# EAGLE design kfly_4layer (EAGLE 5.11)
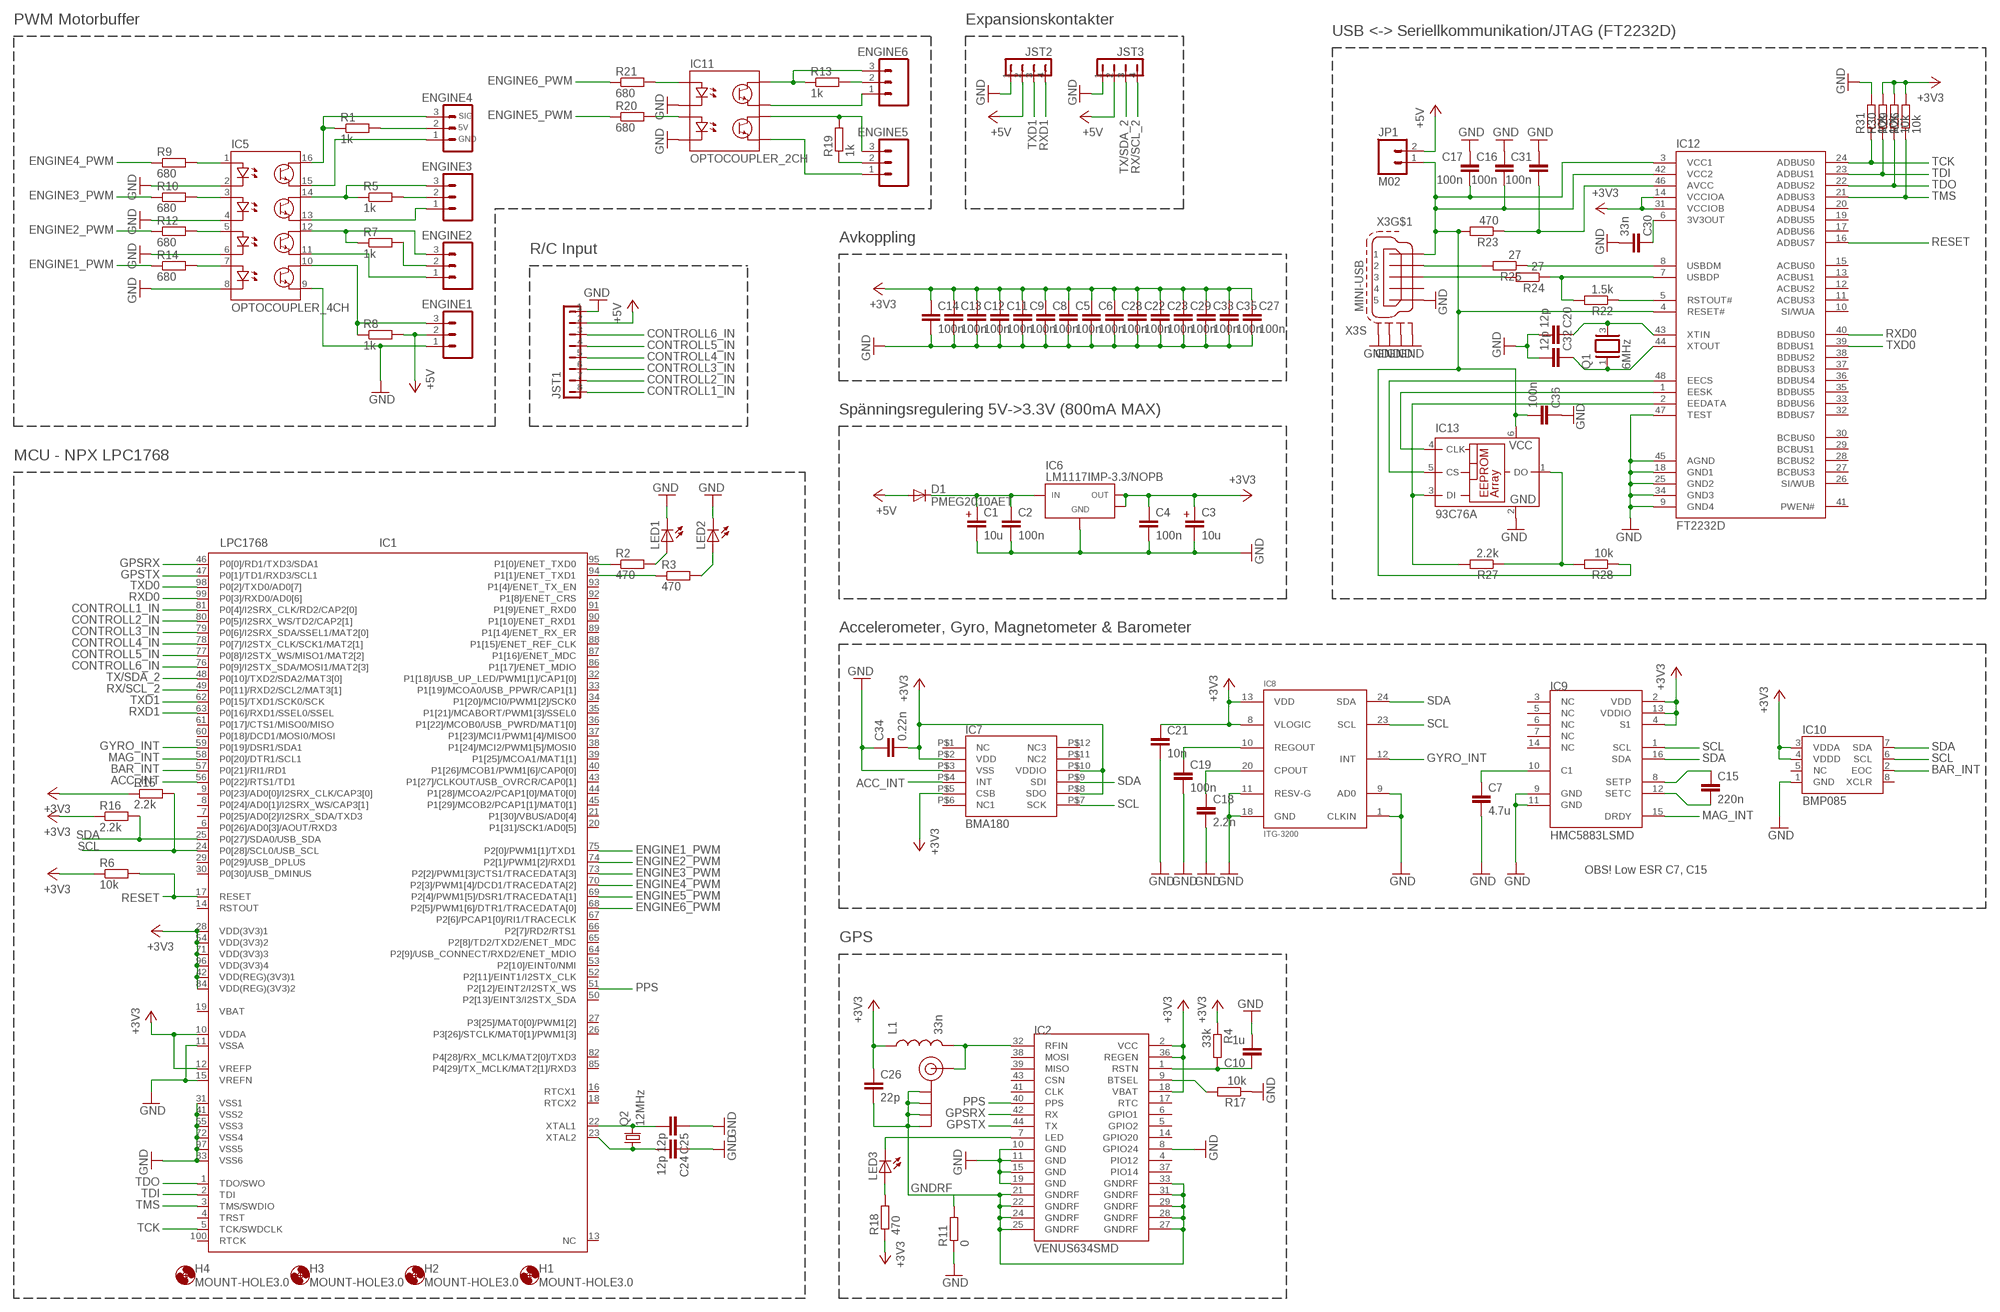
[diagram p0: schematic, sheet 1]

## Parts
C1  10u  C-EUC1206  [C1206]
C2  100n  C-EUC0603  [C0603]
C3  10u  C-EUC1206  [C1206]
C4  100n  C-EUC0603  [C0603]
C5  100n  C-EUC0603  [C0603]
C6  100n  C-EUC0603  [C0603]
C7  4.7u  C-EUC1206  [C1206]
C8  100n  C-EUC0603  [C0603]
C9  100n  C-EUC0603  [C0603]
C10  1u  C-EUC0603  [C0603]
C11  100n  C-EUC0603  [C0603]
C12  100n  C-EUC0603  [C0603]
C13  100n  C-EUC0603  [C0603]
C14  100n  C-EUC0603  [C0603]
C15  220n  C-EUC1206  [C1206]
C16  100n  C-EUC0603  [C0603]
C17  100n  C-EUC0603  [C0603]
C18  2.2n  C-EUC0603  [C0603]
C19  100n  C-EUC0603  [C0603]
C20  12p  C-EUC0603  [C0603]
C21  10n  C-EUC0603  [C0603]
C22  100n  C-EUC0603  [C0603]
C23  100n  C-EUC0603  [C0603]
C24  12p  C-EUC0603  [C0603]
C25  12p  C-EUC0603  [C0603]
C26  22p  C-EUC0603  [C0603]
C27  100n  C-EUC0603  [C0603]
C28  100n  C-EUC0603  [C0603]
C29  100n  C-EUC0603  [C0603]
C30  33n  C-EUC0603  [C0603]
C31  100n  C-EUC0603  [C0603]
C32  12p  C-EUC0603  [C0603]
C33  100n  C-EUC0603  [C0603]
C34  0.22n  C-EUC0603  [C0603]
C35  100n  C-EUC0603  [C0603]
C36  100n  C-EUC0603  [C0603]
D1  PMEG2010AET  DIODESOT23  [SOT23-3]
ENGINE1  M03  [M03]
ENGINE2  M03  [M03]
ENGINE3  M03  [M03]
ENGINE4  M03  [M03]
ENGINE5  M03  [M03]
ENGINE6  M03  [M03]
H1  MOUNT-HOLE3.0  [3,0]
H2  MOUNT-HOLE3.0  [3,0]
H3  MOUNT-HOLE3.0  [3,0]
H4  MOUNT-HOLE3.0  [3,0]
IC1  LPC1768  [LQFP100-14X14]
IC2  VENUS634SMD  [LGA44]
IC5  OPTOCOUPLER_4CH  [SO16]
IC6  LM1117IMP-3.3/NOPB  VREG_SOT223  [SOT223]
IC7  BMA180  [LGA12]
IC8  ITG-3200  [QFN-24]
IC9  HMC5883LSMD  [16LPCC]
IC10  BMP085  [BMP085]
IC11  OPTOCOUPLER_2CH  [SO8]
IC12  FT2232D  [LQFP-48]
IC13  93C76A  [SOT23-6]
J$1  SMA_EDGE  [SMA-EDGE]
JP1  M02  [M02]
JST1  JST-8PIN-TOP-1.0  [JST-8PIN-TOP]
JST2  JST-4PIN-TOP-1.0  [JST-4PIN-TOP]
JST3  JST-4PIN-TOP-1.0  [JST-4PIN-TOP]
L1  33n  INDUCTOR0805  [0805]
LED1  LED0603  [LED-0603]
LED2  LED0603  [LED-0603]
LED3  LED0603  [LED-0603]
Q1  6MHz  5X7CRYSTAL  [5X7CRYSTAL]
Q2  12MHz  CRYSTAL5X3  [CRYSTAL-SMD-5X3]
R1  1k  R-EU_R0402  [R0402]
R2  470  R-EU_R0603  [R0603]
R3  470  R-EU_R0603  [R0603]
R4  33k  R-EU_R0603  [R0603]
R5  1k  R-EU_R0402  [R0402]
R6  10k  R-EU_R0603  [R0603]
R7  1k  R-EU_R0402  [R0402]
R8  1k  R-EU_R0402  [R0402]
R9  680  R-EU_R0603  [R0603]
R10  680  R-EU_R0603  [R0603]
R11  0  R-EU_R0603  [R0603]
R12  680  R-EU_R0603  [R0603]
R13  1k  R-EU_R0402  [R0402]
R14  680  R-EU_R0603  [R0603]
R15  2.2k  R-EU_R0603  [R0603]
R16  2.2k  R-EU_R0603  [R0603]
R17  10k  R-EU_R0603  [R0603]
R18  470  R-EU_R0603  [R0603]
R19  1k  R-EU_R0402  [R0402]
R20  680  R-EU_R0603  [R0603]
R21  680  R-EU_R0603  [R0603]
R22  1.5k  R-EU_R0603  [R0603]
R23  470  R-EU_R0603  [R0603]
R24  27  R-EU_R0603  [R0603]
R25  27  R-EU_R0603  [R0603]
R26  10k  R-EU_R0603  [R0603]
R27  2.2k  R-EU_R0603  [R0603]
R28  10k  R-EU_R0603  [R0603]
R29  10k  R-EU_R0603  [R0603]
R30  10k  R-EU_R0603  [R0603]
R31  10k  R-EU_R0603  [R0603]
X3  MINI-USB  MINI-USB-SCHIELD-32005-201  [32005-201]

## Nets
+3V3: C3.1 C4.1 C5.1 C6.1 C8.1 C9.1 C11.1 C12.1 C13.1 C14.1 C21.1 C22.1 C23.1 C26.1 C27.1 C28.1 C29.1 C33.1 C34.2 C35.1 IC1.10(VDDA) IC1.12(VREFP) IC1.28(VDD(3V3)1) IC1.42(VDD(REG)(3V3)1) IC1.54(VDD(3V3)2) IC1.71(VDD(3V3)3) IC1.84(VDD(REG)(3V3)2) IC1.96(VDD(3V3)4) IC2.2(VCC) IC2.18(VBAT) IC2.36(REGEN) IC6.2 IC6.4 IC7.P$2(VDD) IC7.P$5(CSB) IC7.P$8(SDO) IC7.P$10(VDDIO) IC8.8(VLOGIC) IC8.13(VDD) IC9.2(VDD) IC9.4(S1) IC9.13(VDDIO) IC10.3(VDDA) IC10.4(VDDD) IC12.14(VCCIOA) IC12.31(VCCIOB) L1.1 R4.1 R6.1 R15.1 R16.1 R18.1 R26.2 R29.2 R30.2
+5V: D1.1(A) ENGINE1.2 JP1.2 JST1.2 JST2.2 JST3.2 R8.2
ACC_INT: IC1.56(P0[22]/RTS1/TD1) IC7.P$4(INT)
BAR_INT: IC1.57(P0[21]/RI1/RD1) IC10.2(EOC)
CONTROLL1_IN: IC1.81(P0[4]/I2SRX_CLK/RD2/CAP2[0]) JST1.8
CONTROLL2_IN: IC1.80(P0[5]/I2SRX_WS/TD2/CAP2[1]) JST1.7
CONTROLL3_IN: IC1.79(P0[6]/I2SRX_SDA/SSEL1/MAT2[0]) JST1.6
CONTROLL4_IN: IC1.78(P0[7]/I2STX_CLK/SCK1/MAT2[1]) JST1.5
CONTROLL5_IN: IC1.77(P0[8]/I2STX_WS/MISO1/MAT2[2]) JST1.4
CONTROLL6_IN: IC1.76(P0[9]/I2STX_SDA/MOSI1/MAT2[3]) JST1.3
ENGINE1_PWM: IC1.75(P2[0]/PWM1[1]/TXD1) R14.1
ENGINE2_PWM: IC1.74(P2[1]/PWM1[2]/RXD1) R12.1
ENGINE3_PWM: IC1.73(P2[2]/PWM1[3]/CTS1/TRACEDATA[3]) R10.1
ENGINE4_PWM: IC1.70(P2[3]/PWM1[4]/DCD1/TRACEDATA[2]) R9.1
ENGINE5_PWM: IC1.69(P2[4]/PWM1[5]/DSR1/TRACEDATA[1]) R20.1
ENGINE6_PWM: IC1.68(P2[5]/PWM1[6]/DTR1/TRACEDATA[0]) R21.1
GND: C1.2 C2.2 C3.2 C4.2 C5.2 C6.2 C7.2 C8.2 C9.2 C10.2 C11.2 C12.2 C13.2 C14.2 C16.1 C17.1 C18.2 C19.2 C20.2 C21.2 C22.2 C23.2 C24.1 C25.1 C27.2 C28.2 C29.2 C30.2 C31.1 C32.2 C33.2 C34.1 C35.2 C36.1 ENGINE1.1 IC1.11(VSSA) IC1.15(VREFN) IC1.31(VSS1) IC1.41(VSS2) IC1.55(VSS3) IC1.72(VSS4) IC1.83(VSS6) IC1.97(VSS5) IC2.8(GPIO24) IC2.10(GND) IC2.11(GND) IC2.15(GND) IC2.19(GND) IC5.2 IC5.4 IC5.6 IC5.8 IC5.9 IC6.1 IC7.P$3(VSS) IC8.1(CLKIN) IC8.9(AD0) IC8.11(RESV-G) IC8.18(GND) IC9.9(GND) IC9.11(GND) IC10.1(GND) IC11.2 IC11.4 IC12.9(GND4) IC12.18(GND1) IC12.25(GND2) IC12.34(GND3) IC12.45(AGND) IC12.47(TEST) IC13.2(GND) JST1.1 JST2.1 JST3.1 LED1.C LED2.C R11.1 R17.1 R31.2 X3.5 X3.M1(S:S1) X3.M2(S:S2) X3.M3(S:S3) X3.M4(S:S4)
GNDRF: C26.2 IC2.21(GNDRF) IC2.22(GNDRF) IC2.24(GNDRF) IC2.25(GNDRF) IC2.27(GNDRF) IC2.28(GNDRF) IC2.29(GNDRF) IC2.31(GNDRF) IC2.33(GNDRF) J$1.GND@0(GND) J$1.GND@1(GND) J$1.GND@2(GND) J$1.GND@3(GND) R11.2
GPSRX: IC1.46(P0[0]/RD1/TXD3/SDA1) IC2.42(RX)
GPSTX: IC1.47(P0[1]/TD1/RXD3/SCL1) IC2.44(TX)
GYRO_INT: IC1.59(P0[19]/DSR1/SDA1) IC8.12(INT)
MAG_INT: IC1.58(P0[20]/DTR1/SCL1) IC9.15(DRDY)
N$1: C7.1 IC9.10(C1)
N$2: R25.2 X3.2
N$3: ENGINE4.1 IC5.15
N$4: IC12.8(USBDM) R25.1
N$5: ENGINE6.3 IC11.8 R13.1
N$6: ENGINE6.1 IC11.7
N$7: IC12.7(USBDP) R22.2 R24.1
N$8: C15.1 IC9.8(SETP)
N$9: IC1.95(P1[0]/ENET_TXD0) R2.1
N$10: C15.2 IC9.12(SETC)
N$11: ENGINE6.2 R13.2
N$12: ENGINE5.3 IC11.6 R19.2
N$13: C18.1 IC8.20(CPOUT)
N$14: C19.1 IC8.10(REGOUT)
N$15: LED1.A R2.2
N$16: C16.2 C17.2 C36.2 IC12.3(VCC1) IC12.4(RESET#) IC12.42(VCC2) IC13.6(VCC) JP1.1 R23.2 R28.1 X3.1
N$17: ENGINE4.3 IC5.16 R1.1
N$18: IC1.94(P1[1]/ENET_TXD1) R3.1
N$19: IC2.32(RFIN) J$1.SIG(SIGNAL) L1.2
N$20: LED2.A R3.2
N$21: C10.1 IC2.1(RSTN) R4.2
N$22: ENGINE4.2 R1.2
N$23: C1.1 C2.1 D1.3(C) IC6.3
N$24: ENGINE3.1 IC5.13
N$25: ENGINE3.3 IC5.14 R5.1
N$26: ENGINE3.2 R5.2
N$27: ENGINE2.3 IC5.12 R7.1
N$28: ENGINE2.1 IC5.11
N$29: ENGINE2.2 R7.2
N$30: ENGINE1.3 IC5.10 R8.1
N$31: IC5.1 R9.2
N$32: IC5.3 R10.2
N$33: IC5.5 R12.2
N$34: IC5.7 R14.2
N$35: IC2.9(BTSEL) R17.2
N$36: ENGINE5.2 R19.1
N$37: ENGINE5.1 IC11.5
N$38: IC11.1 R21.2
N$39: LED3.A R18.2
N$40: IC2.7(LED) LED3.C
N$41: IC11.3 R20.2
N$42: C25.2 IC1.22(XTAL1) Q2.3
N$43: C24.2 IC1.23(XTAL2) Q2.1
N$45: R24.2 X3.3
N$46: IC12.1(EESK) IC13.4(CLK)
N$47: C31.2 IC12.46(AVCC) R23.1
N$48: C30.1 IC12.6(3V3OUT)
N$49: IC12.48(EECS) IC13.5(CS)
N$51: IC12.5(RSTOUT#) R22.1
N$52: C20.1 IC12.43(XTIN) Q1.3
N$53: C32.1 IC12.44(XTOUT) Q1.1
N$54: IC12.2(EEDATA) IC13.3(DI) R27.2
N$55: IC13.1(DO) R27.1 R28.2
PPS: IC1.51(P2[12]/EINT2/I2STX_WS) IC2.40(PPS)
RESET: IC1.17(RESET) IC12.16(ADBUS7) R6.2
RX/SCL_2: IC1.49(P0[11]/RXD2/SCL2/MAT3[1]) JST3.4
RXD0: IC1.99(P0[3]/RXD0/AD0[6]) IC12.40(BDBUS0)
RXD1: IC1.63(P0[16]/RXD1/SSEL0/SSEL) JST2.4
SCL: IC1.24(P0[28]/SCL0/USB_SCL) IC7.P$7(SCK) IC8.23(SCL) IC9.1(SCL) IC10.6(SCL) R15.2
SDA: IC1.25(P0[27]/SDA0/USB_SDA) IC7.P$9(SDI) IC8.24(SDA) IC9.16(SDA) IC10.7(SDA) R16.2
TCK: IC1.5(TCK/SWDCLK) IC12.24(ADBUS0) R31.1
TDI: IC1.2(TDI) IC12.23(ADBUS1) R30.1
TDO: IC1.1(TDO/SWO) IC12.22(ADBUS2) R29.1
TMS: IC1.3(TMS/SWDIO) IC12.21(ADBUS3) R26.1
TX/SDA_2: IC1.48(P0[10]/TXD2/SDA2/MAT3[0]) JST3.3
TXD0: IC1.98(P0[2]/TXD0/AD0[7]) IC12.39(BDBUS1)
TXD1: IC1.62(P0[15]/TXD1/SCK0/SCK) JST2.3
Unconnected: IC1.4(TRST) IC1.6(P0[26]/AD0[3]/AOUT/RXD3) IC1.7(P0[25]/AD0[2]/I2SRX_SDA/TXD3) IC1.8(P0[24]/AD0[1]/I2SRX_WS/CAP3[1]) IC1.9(P0[23]/AD0[0]/I2SRX_CLK/CAP3[0]) IC1.13(NC) IC1.14(RSTOUT) IC1.16(RTCX1) IC1.18(RTCX2) IC1.19(VBAT) IC1.20(P1[31]/SCK1/AD0[5]) IC1.21(P1[30]/VBUS/AD0[4]) IC1.26(P3[26]/STCLK/MAT0[1]/PWM1[3]) IC1.27(P3[25]/MAT0[0]/PWM1[2]) IC1.29(P0[29]/USB_DPLUS) IC1.30(P0[30]/USB_DMINUS) IC1.32(P1[18]/USB_UP_LED/PWM1[1]/CAP1[0]) IC1.33(P1[19]/MCOA0/USB_PPWR/CAP1[1]) IC1.34(P1[20]/MCI0/PWM1[2]/SCK0) IC1.35(P1[21]/MCABORT/PWM1[3]/SSEL0) IC1.36(P1[22]/MCOB0/USB_PWRD/MAT1[0]) IC1.37(P1[23]/MCI1/PWM1[4]/MISO0) IC1.38(P1[24]/MCI2/PWM1[5]/MOSI0) IC1.39(P1[25]/MCOA1/MAT1[1]) IC1.40(P1[26]/MCOB1/PWM1[6]/CAP0[0]) IC1.43(P1[27]/CLKOUT/USB_OVRCR/CAP0[1]) IC1.44(P1[28]/MCOA2/PCAP1[0]/MAT0[0]) IC1.45(P1[29]/MCOB2/PCAP1[1]/MAT0[1]) IC1.50(P2[13]/EINT3/I2STX_SDA) IC1.52(P2[11]/EINT1/I2STX_CLK) IC1.53(P2[10]/EINT0/NMI) IC1.60(P0[18]/DCD1/MOSI0/MOSI) IC1.61(P0[17]/CTS1/MISO0/MISO) IC1.64(P2[9]/USB_CONNECT/RXD2/ENET_MDIO) IC1.65(P2[8]/TD2/TXD2/ENET_MDC) IC1.66(P2[7]/RD2/RTS1) IC1.67(P2[6]/PCAP1[0]/RI1/TRACECLK) IC1.82(P4[28]/RX_MCLK/MAT2[0]/TXD3) IC1.85(P4[29]/TX_MCLK/MAT2[1]/RXD3) IC1.86(P1[17]/ENET_MDIO) IC1.87(P1[16]/ENET_MDC) IC1.88(P1[15]/ENET_REF_CLK) IC1.89(P1[14]/ENET_RX_ER) IC1.90(P1[10]/ENET_RXD1) IC1.91(P1[9]/ENET_RXD0) IC1.92(P1[8]/ENET_CRS) IC1.93(P1[4]/ENET_TX_EN) IC1.100(RTCK) IC2.4(PIO12) IC2.5(GPIO2) IC2.6(GPIO1) IC2.14(GPIO20) IC2.17(RTC) IC2.37(PIO14) IC2.38(MOSI) IC2.39(MISO) IC2.41(CLK) IC2.43(CSN) IC7.P$1(NC) IC7.P$6(NC1) IC7.P$11(NC2) IC7.P$12(NC3) IC9.3(NC) IC9.5(NC) IC9.6(NC) IC9.7(NC) IC9.14(NC) IC10.5(NC) IC10.8(XCLR) IC12.10(SI/WUA) IC12.11(ACBUS3) IC12.12(ACBUS2) IC12.13(ACBUS1) IC12.15(ACBUS0) IC12.17(ADBUS6) IC12.19(ADBUS5) IC12.20(ADBUS4) IC12.26(SI/WUB) IC12.27(BCBUS3) IC12.28(BCBUS2) IC12.29(BCBUS1) IC12.30(BCBUS0) IC12.32(BDBUS7) IC12.33(BDBUS6) IC12.35(BDBUS5) IC12.36(BDBUS4) IC12.37(BDBUS3) IC12.38(BDBUS2) IC12.41(PWEN#) X3.4

## Notes on the sheet
- PWM Motorbuffer | Expansionskontakter
- USB <-> Seriellkommunikation/JTAG (FT2232D)
- SIG
- 5V
- GND
- Avkoppling
- R/C Input
- Spänningsregulering 5V->3.3V (800mA MAX)
- MCU - NPX LPC1768
- + | +
- Accelerometer, Gyro, Magnetometer & Barometer
- OBS! Low ESR C7, C15
- GPS

## Library data of the parts
C1-C36 = rcl:C-EU: CAPACITOR, European symbol
D1 = SparkFun:DIODE: Diode These are standard reverse protection diodes and small signal diodes. SMA package can handle up to about 1A. SOD-323 can handle about 200mA. What the SOD-323 package when ordering, there are some mfgs out there that are 5-pin packages.
ENGINE1-ENGINE6 = korken:M03
H1-H4 = holes:MOUNT-HOLE: MOUNTING HOLE with drill center marker
IC1 = lpc1xxx-v6:LPC1768: LPC1768 100 MHz 32-bit ARM Cortex-M3 based microcontroller featuring a high level of integration and low power consumption. 512 kB Flash, 64 kB SRAM, USB Device/Host/OTG, 2 CAN, DAC, Ethernet MarcVl - Datasheet available on www.nxp.com
IC2 = SparkFun:VENUS634: Venus634 from SkyTraq
IC5 = korken:OPTOCOUPLER_4CH
IC6 = korken:VREG_SOT223
IC7 = SparkFun:BMA180
IC8 = SparkFun:ITG-3200: ITG-3200 3-axis gyro, digital output, qfn24 package
IC9 = SparkFun:HMC5883L: 3 Axis Digital Compass IC
IC10 = SparkFun:BMP085: BMP085 Pressure Sensor Great little MEMS pressure sensor. SKU: COM-09603
IC11 = korken:OPTOCOUPLER_2CH
IC12 = SparkFun:FT2232D
IC13 = microchip:93*76?: 8K Microwire Compatible Serial EEPROM Source: http://ww1.microchip.com/downloads/en/DeviceDoc/21796H.pdf
J$1 = SparkFun:SMA_EDGE: SMA Antenna Connector End launch SMA connector. The paste layer has been removed so that the connector can be hand soldered onto the board after reflow.
JP1 = korken:M02
JST1 = korken:JST-8PIN-TOP-1.0
JST2 JST3 = korken:JST-4PIN-TOP-1.0
L1 = SparkFun:INDUCTOR: Inductors Basic Inductor/Choke - 0603 and 1206. Footprints are not proven and vary greatly between part numbers.
LED1-LED3 = SparkFun:LED: LEDs Standard schematic elements and footprints for 5mm, 3mm, 1206, and 0603 sized LEDs. 5mm - Spark Fun Electronics SKU : COM-00529 (and others)
Q1 = korken:5X7CRYSTAL
Q2 = SparkFun:CRYSTAL: Crystals Various standard crystals. Proven footprints. Spark Fun Electronics SKU : COM-00534
R1-R31 = rcl:R-EU_: RESISTOR, European symbol
X3 = con-cypressindustries:MINI-USB-SCHIELD-: MINI USB-B Conector Source: www.cypressindustries.com

## Board
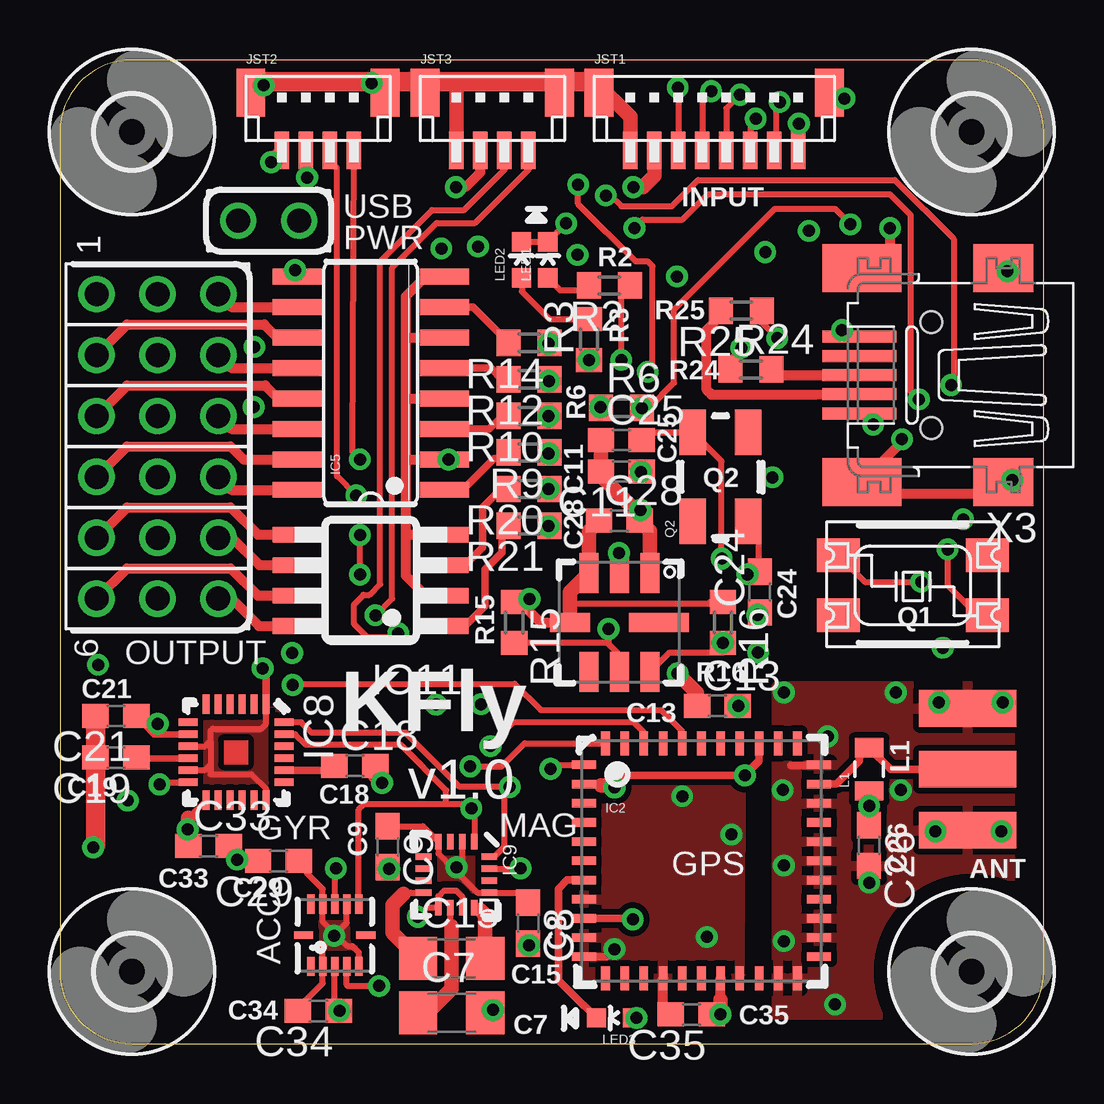
[diagram p1: board, top side]
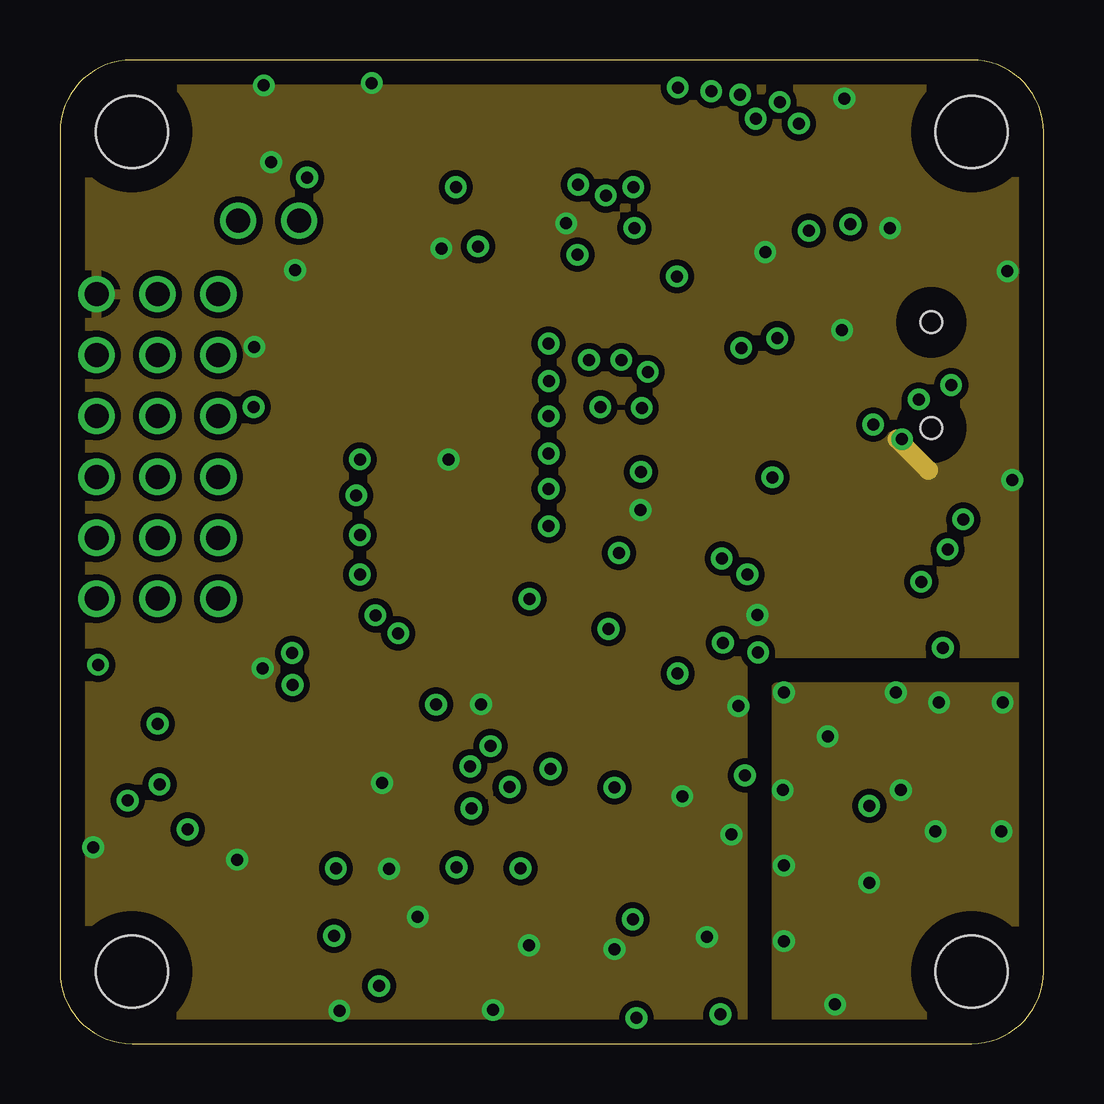
[diagram p2: board, inner layer Inner1]
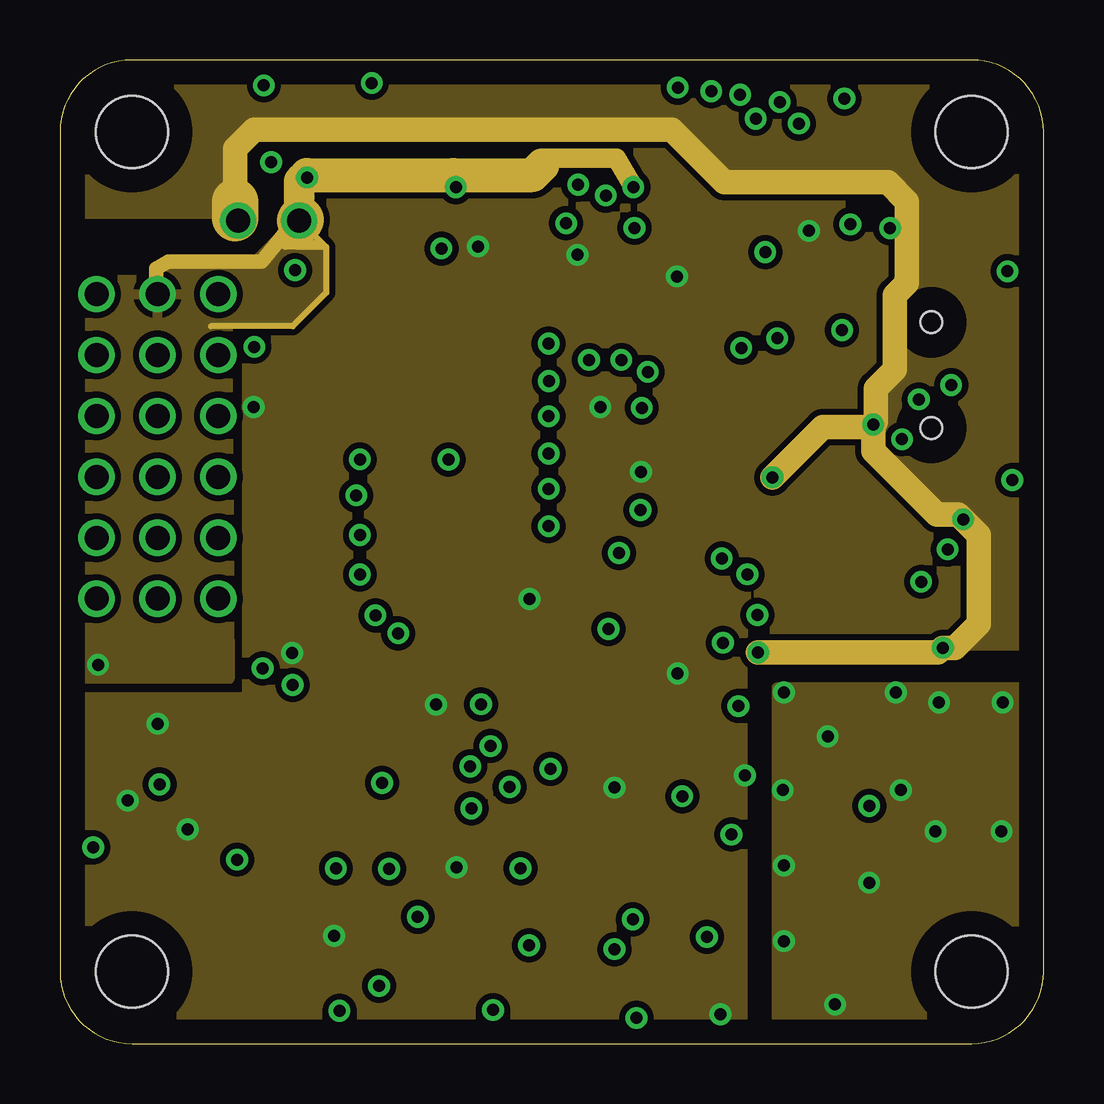
[diagram p3: board, inner layer Inner2]
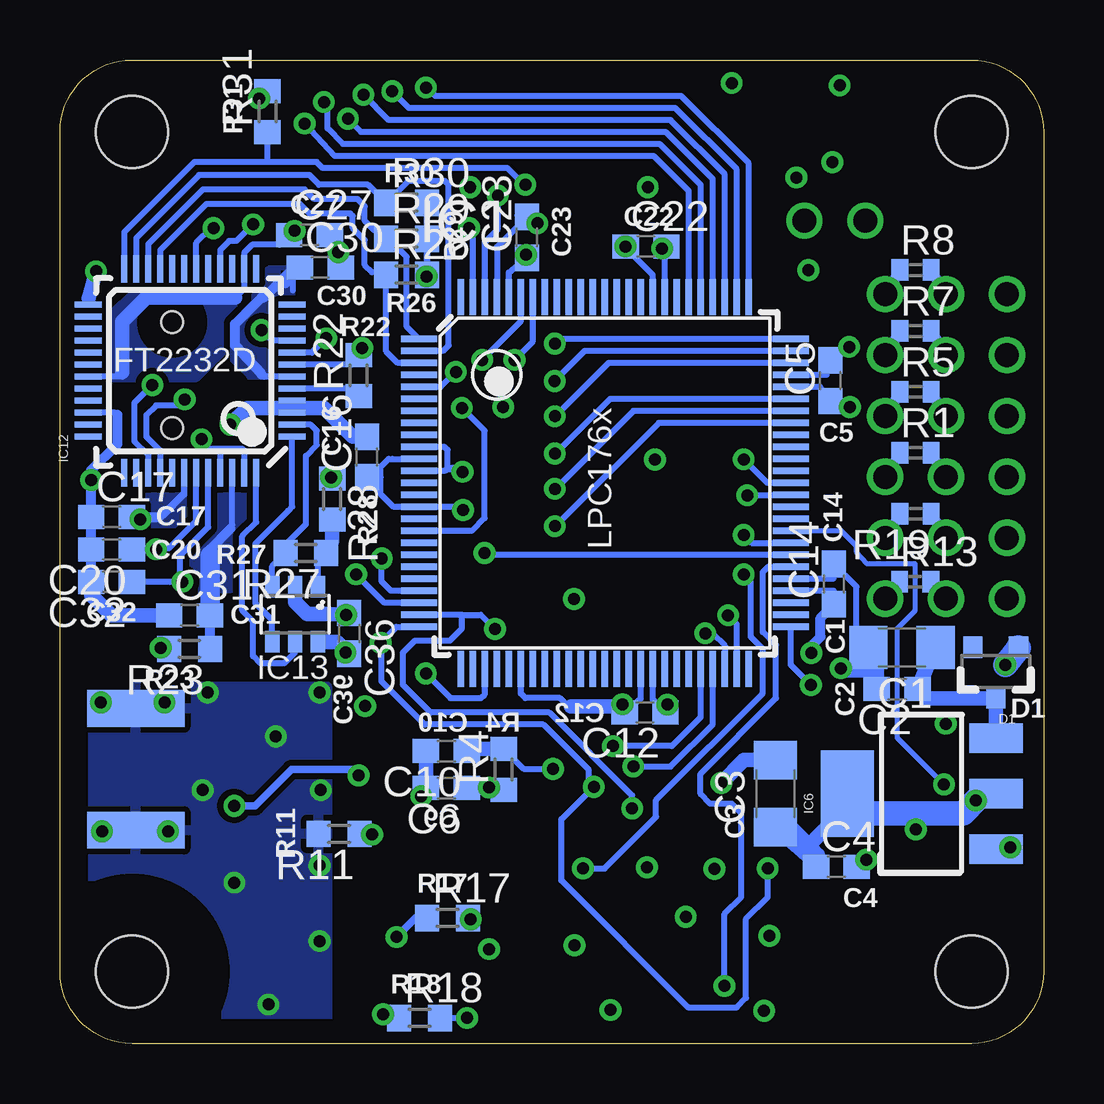
[diagram p4: board, bottom side, seen from below]

Size 41 x 41 mm. Coordinates in mm from the lower left corner, seen from the top.
Outline: 41,38 arc90 38,41 3,41 arc90 0,38 0,3 arc90 3,0 38,0 arc90 41,3 41,38
Copper layers (1*2*15*16): Top 0.035mm / dielectric 1.5mm / Inner1 0.035mm / dielectric 0.15mm / Inner2 0.035mm / dielectric 0.2mm / Bottom 0.035mm
Design rules "default *": minimum track width 10mil, minimum drill 24mil, track to track 10mil, track to pad 10mil, pad to pad 10mil, via to via 10mil, smd to smd 10mil, copper to edge 40mil, drill to drill 8mil, minimum pad ring 10mil, minimum via ring 8mil, stop-mask expansion 4mil, vias tented up to drill 0mil, thermal gap 10mil

### Footprints (pad centres in the part's own frame; a part is rotated, then mirrored left to right if it is on the bottom)
C1206 = smd 1.6 x 1.8: 1 -1.4,0; 2 1.4,0
C0603 = smd 1.1 x 1: 1 -0.85,0; 2 0.85,0
SOT23-3 = smd 0.8 x 0.9: 1 -0.95,-1; 2 0.95,-1; 3 0,1.1
M03 = drill 1 round: 1 -2.54,0; 2 0,0; 3 2.54,0
3,0 = hole 3: 0,0
LQFP100-14X14 = smd 0.27 x 1.5: 1 -6,-7.75; 2 -5.5,-7.75; 3 -5,-7.75; 4 -4.5,-7.75; 5 -4,-7.75; 6 -3.5,-7.75; 7 -3,-7.75; 8 -2.5,-7.75; 9 -2,-7.75; 10 -1.5,-7.75; 11 -1,-7.75; 12 -0.5,-7.75; 13 0,-7.75; 14 0.5,-7.75; 15 1,-7.75; 16 1.5,-7.75; 17 2,-7.75; 18 2.5,-7.75; 19 3,-7.75; 20 3.5,-7.75; 21 4,-7.75; 22 4.5,-7.75; 23 5,-7.75; 24 5.5,-7.75; 25 6,-7.75; 51 6,7.75; 52 5.5,7.75; 53 5,7.75; 54 4.5,7.75; 55 4,7.75; 56 3.5,7.75; 57 3,7.75; 58 2.5,7.75; 59 2,7.75; 60 1.5,7.75; 61 1,7.75; 62 0.5,7.75; 63 0,7.75; 64 -0.5,7.75; 65 -1,7.75; 66 -1.5,7.75; 67 -2,7.75; 68 -2.5,7.75; 69 -3,7.75; 70 -3.5,7.75; 71 -4,7.75; 72 -4.5,7.75; 73 -5,7.75; 74 -5.5,7.75; 75 -6,7.75 | smd 1.5 x 0.27: 26 7.75,-6; 27 7.75,-5.5; 28 7.75,-5; 29 7.75,-4.5; 30 7.75,-4; 31 7.75,-3.5; 32 7.75,-3; 33 7.75,-2.5; 34 7.75,-2; 35 7.75,-1.5; 36 7.75,-1; 37 7.75,-0.5; 38 7.75,0; 39 7.75,0.5; 40 7.75,1; 41 7.75,1.5; 42 7.75,2; 43 7.75,2.5; 44 7.75,3; 45 7.75,3.5; 46 7.75,4; 47 7.75,4.5; 48 7.75,5; 49 7.75,5.5; 50 7.75,6; 76 -7.75,6; 77 -7.75,5.5; 78 -7.75,5; 79 -7.75,4.5; 80 -7.75,4; 81 -7.75,3.5; 82 -7.75,3; 83 -7.75,2.5; 84 -7.75,2; 85 -7.75,1.5; 86 -7.75,1; 87 -7.75,0.5; 88 -7.75,0; 89 -7.75,-0.5; 90 -7.75,-1; 91 -7.75,-1.5; 92 -7.75,-2; 93 -7.75,-2.5; 94 -7.75,-3; 95 -7.75,-3.5; 96 -7.75,-4; 97 -7.75,-4.5; 98 -7.75,-5; 99 -7.75,-5.5; 100 -7.75,-6
LGA44 = smd 1 x 0.36: 1 -4.9,4; 2 -4.9,3.2; 3 -4.9,2.4; 4 -4.9,1.6; 5 -4.9,0.8; 6 -4.9,0; 7 -4.9,-0.8; 8 -4.9,-1.6; 9 -4.9,-2.4; 10 -4.9,-3.2; 11 -4.9,-4; 23 4.9,-4; 24 4.9,-3.2; 25 4.9,-2.4; 26 4.9,-1.6; 27 4.9,-0.8; 28 4.9,0; 29 4.9,0.8; 30 4.9,1.6; 31 4.9,2.4; 32 4.9,3.2; 33 4.9,4 | smd 0.36 x 1: 12 -4,-4.9; 13 -3.2,-4.9; 14 -2.4,-4.9; 15 -1.6,-4.9; 16 -0.8,-4.9; 17 0,-4.9; 18 0.8,-4.9; 19 1.6,-4.9; 20 2.4,-4.9; 21 3.2,-4.9; 22 4,-4.9; 34 4,4.9; 35 3.2,4.9; 36 2.4,4.9; 37 1.6,4.9; 38 0.8,4.9; 39 0,4.9; 40 -0.8,4.9; 41 -1.6,4.9; 42 -2.4,4.9; 43 -3.2,4.9; 44 -4,4.9
SO16 = smd 0.66 x 2.032: 1 -4.605,-3.073; 2 -3.335,-3.073; 3 -2.065,-3.073; 4 -0.795,-3.073; 5 0.475,-3.073; 6 1.745,-3.073; 7 3.015,-3.073; 8 4.285,-3.073; 9 4.285,3.073; 10 3.015,3.073; 11 1.745,3.073; 12 0.475,3.073; 13 -0.795,3.073; 14 -2.065,3.073; 15 -3.335,3.073; 16 -4.605,3.073
SOT223 = smd 1.219 x 2.235: 1 -2.311,-3.099; 2 0,-3.099; 3 2.311,-3.099 | smd 3.6 x 2.2: 4 0,3.099
LGA12 = smd 0.8 x 0.32: P$1 -1.3,1; P$2 -1.3,0.5; P$3 -1.3,0; P$4 -1.3,-0.5; P$5 -1.3,-1; P$7 1.3,-1; P$8 1.3,-0.5; P$9 1.3,0; P$10 1.3,0.5; P$11 1.3,1 | smd 0.32 x 0.8: P$6 0,-1.3; P$12 0,1.3
QFN-24 = smd 0.8 x 0.3: 1 -2,1.25; 2 -2,0.75; 3 -2,0.25; 4 -2,-0.25; 5 -2,-0.75; 6 -2,-1.25; 13 2,-1.25; 14 2,-0.75; 15 2,-0.25; 16 2,0.25; 17 2,0.75; 18 2,1.25 | smd 0.3 x 0.8: 7 -1.25,-2; 8 -0.75,-2; 9 -0.25,-2; 10 0.25,-2; 11 0.75,-2; 12 1.25,-2; 19 1.25,2; 20 0.75,2; 21 0.25,2; 22 -0.25,2; 23 -0.75,2; 24 -1.25,2
16LPCC = smd 0.65 x 0.28: 1 -1.37,0.75; 2 -1.37,0.25; 3 -1.37,-0.25; 4 -1.37,-0.75; 9 1.37,-0.75; 10 1.37,-0.25; 11 1.37,0.25; 12 1.37,0.75 | smd 0.28 x 0.65: 5 -0.75,-1.37; 6 -0.25,-1.37; 7 0.25,-1.37; 8 0.75,-1.37; 13 0.75,1.37; 14 0.25,1.37; 15 -0.25,1.37; 16 -0.75,1.37
BMP085 = smd 1.67 x 0.8: 1 -2.065,1.27; 2 -2.065,0; 3 -2.065,-1.27; 5 2.065,-1.27; 6 2.065,0; 7 2.065,1.27 | smd 0.8 x 1.67: 4 0,-2.065 | smd 0.8 x 2.5: 8 0,1.65
SO8 = smd 0.66 x 2.032: 1 -1.905,-3.066; 2 -0.635,-3.066; 3 0.635,-3.066; 4 1.905,-3.066; 5 1.905,3.066; 6 0.635,3.066; 7 -0.635,3.066; 8 -1.905,3.066
LQFP-48 = smd 0.254 x 1.143: 1 -2.75,-4.25; 2 -2.25,-4.25; 3 -1.75,-4.25; 4 -1.25,-4.25; 5 -0.75,-4.25; 6 -0.25,-4.25; 7 0.25,-4.25; 8 0.75,-4.25; 9 1.25,-4.25; 10 1.75,-4.25; 11 2.25,-4.25; 12 2.75,-4.25; 25 2.75,4.25; 26 2.25,4.25; 27 1.75,4.25; 28 1.25,4.25; 29 0.75,4.25; 30 0.25,4.25; 31 -0.25,4.25; 32 -0.75,4.25; 33 -1.25,4.25; 34 -1.75,4.25; 35 -2.25,4.25; 36 -2.75,4.25 | smd 1.143 x 0.254: 13 4.25,-2.75; 14 4.25,-2.25; 15 4.25,-1.75; 16 4.25,-1.25; 17 4.25,-0.75; 18 4.25,-0.25; 19 4.25,0.25; 20 4.25,0.75; 21 4.25,1.25; 22 4.25,1.75; 23 4.25,2.25; 24 4.25,2.75; 37 -4.25,2.75; 38 -4.25,2.25; 39 -4.25,1.75; 40 -4.25,1.25; 41 -4.25,0.75; 42 -4.25,0.25; 43 -4.25,-0.25; 44 -4.25,-0.75; 45 -4.25,-1.25; 46 -4.25,-1.75; 47 -4.25,-2.25; 48 -4.25,-2.75
SOT23-6 = smd 0.6 x 0.9: 1 -0.95,-1.15; 2 0,-1.15; 3 0.95,-1.15; 4 0.95,1.15; 5 0,1.15; 6 -0.95,1.15
SMA-EDGE = smd 1.524 x 4.064: GND@0 0,0; GND@1 5.08,0; SIG 2.54,0 | smd 1.524 x 4.064 bottom: GND@2 0,0; GND@3 5.08,0
M02 = drill 1 round: 1 -1.27,0; 2 1.27,0
JST-8PIN-TOP = smd 0.6 x 1.55: 1 -5,0; 2 -4,0; 3 -3,0; 4 -2,0; 5 -1,0; 6 0,0; 7 1,0; 8 2,0 | smd 1.2 x 2: NC1 3.3,2.4; NC2 -6.3,2.4
JST-4PIN-TOP = smd 0.6 x 1.55: 1 -2,0; 2 -1,0; 3 0,0; 4 1,0 | smd 1.2 x 2: NC1 2.3,2.4; NC2 -3.3,2.4
0805 = smd 0.8 x 1.2: 1 -0.9,0; 2 0.9,0
LED-0603 = smd 0.8 x 0.8: A 0,-0.75; C 0,0.75
5X7CRYSTAL = smd 1.8 x 1.4: 1 -3.1,1.3; 2 3.1,1.3; 3 3.1,-1.2; 4 -3.1,-1.2
CRYSTAL-SMD-5X3 = smd 1.9 x 1.1: 1 -1.85,-1.15; 2 1.85,-1.15; 3 1.85,1.15; 4 -1.85,1.15
R0402 = smd 0.7 x 0.9: 1 -0.65,0; 2 0.65,0
R0603 = smd 1 x 1.1: 1 -0.85,0; 2 0.85,0
32005-201 = smd 3.1 x 0.5: 1 3,1.6; 2 3,0.8; 3 3,0; 4 3,-0.8; 5 3,-1.6 | smd 2.5 x 2: M1 -3,-4.45; M2 -3,4.45 | smd 3.3 x 2: M3 2.9,4.45; M4 2.9,-4.45 | hole 0.9: 0,2.2; 0,-2.2

### Placement (x,y rotation side)
C1  5.9,16.51 180 bottom
C2  6.1,14.78 180 bottom
C3  11.18,10.41 90 bottom
C4  8.64,7.37 0 bottom
C5  8.89,27.63 90 bottom
C6  24.89,10.65 180 bottom
C7  16.33,1.28 0 top
C8  19.52,5.02 270 top
C9  13.66,8.21 270 top
C10  24.89,12.19 180 bottom
C11  23.4,23.85 180 top
C12  16.61,13.81 180 bottom
C13  27.41,14.07 0 top
C14  8.73,19.16 90 bottom
C15  16.33,3.55 0 top
C16  28.2,24.45 90 bottom
C17  38.85,21.95 0 bottom
C18  12.29,11.58 0 top
C19  2.34,11.92 180 top
C20  38.85,20.6 180 bottom
C21  2.34,13.66 180 top
C22  16.57,33.22 0 bottom
C23  21.53,33.6 90 bottom
C24  29.18,18.82 90 top
C25  23.4,25.15 0 top
C26  33.73,8.26 270 top
C27  30.6,33.7 0 bottom
C28  23.32,21.79 0 top
C29  9.11,7.61 180 top
C30  30.15,32.35 0 bottom
C31  35.6,17.85 0 bottom
C32  38.85,19.25 180 bottom
C33  6.2,8.23 0 top
C34  10.77,1.37 180 top
C35  26.31,1.22 180 top
C36  28.95,17.1 270 bottom
D1  1.99,15.51 180 bottom
ENGINE1  4.06,31.24 0 top
ENGINE2  4.06,28.7 0 top
ENGINE3  4.06,26.16 0 top
ENGINE4  4.06,23.62 0 top
ENGINE5  4.06,21.08 0 top
ENGINE6  4.06,18.54 0 top
H1  38,38 0 top
H2  3,38 0 top
H3  38,3 0 top
H4  3,3 0 top
IC1  18.29,23.37 270 bottom
IC2  26.74,7.62 0 top
IC5  12.95,27.69 90 top
IC6  5.08,10.41 90 bottom
IC7  11.45,4.52 90 top
IC8  7.34,12.14 270 top
IC9  16.53,7.04 270 top
IC10  23.32,17.55 270 top
IC11  12.95,19.3 90 top
IC12  35.57,28.05 90 bottom
IC13  31.2,17.9 180 bottom
J$1  37.84,8.89 90 top
JP1  8.7,34.3 0 top
JST1  28.77,37.23 0 top
JST2  11.26,37.23 0 top
JST3  18.52,37.23 0 top
L1  33.73,11.43 90 top
LED1  20.33,32.67 0 top
LED2  19.24,32.67 0 top
LED3  23.11,1.07 90 top
Q1  35.55,19.05 0 top
Q2  27.53,23.63 90 top
R1  5.33,24.62 0 bottom
R2  22.9,31.6 180 top
R3  22.05,29.35 90 top
R4  22.5,11.43 90 bottom
R5  5.33,27.16 0 bottom
R6  23.4,26.5 0 top
R7  5.33,29.7 0 bottom
R8  5.33,32.24 0 bottom
R9  19.56,24.64 180 top
R10  19.56,26.16 180 top
R11  29.36,8.74 180 bottom
R12  19.56,27.69 180 top
R13  5.35,19.25 0 bottom
R14  19.56,29.21 180 top
R15  18.94,17.55 270 top
R16  27.64,17.55 270 top
R17  24.84,5.23 0 bottom
R18  26.01,1.07 0 bottom
R19  5.33,22.08 180 bottom
R20  19.56,23.11 180 top
R21  19.56,21.59 180 top
R22  28.55,27.85 90 bottom
R23  35.6,16.45 180 bottom
R24  28.8,28.1 0 top
R25  28.4,30.55 180 top
R26  26.55,32.05 0 bottom
R27  30.75,20.45 180 bottom
R28  29.65,22.7 270 bottom
R29  26.55,33.55 0 bottom
R30  26.55,35.05 0 bottom
R31  32.35,38.85 90 bottom
X3  36.32,27.86 180 top

### Tracks (layer width: path | path; a pad name or v marks a point on that pad's centre or on a via)
+3V3  (via drill 0.5)
  Top 0.254: v16.53,7.34 16.59,7.08 16.62,7.08 17.41,6.29 IC9.13 19.28,6.29 C8.1 | IC9.2 16.78,7.29 v16.53,7.34 | v16.53,7.34 16.42,7.15 16.42,7.28 15.78,7.92 IC9.4 15.13,9.06 C9.1 | 11.48,4.57 10.95,5.09 IC7.P$10 10.95,6.45 10.3,7.1 10.3,7.27 C29.1 | IC7.P$8 11.95,5.04 11.48,4.57 | 11.48,4.57 10.95,4.04 IC7.P$2 10.95,2.51 9.92,1.48 C34.2 | IC7.P$5 12.45,3.8 12.19,4.06 11.99,4.06 11.48,4.57 | L1.1 C26.1 | IC8.13 5.35,9.4 | R16.1 27.08,18.4 27.08,18.34 21.26,18.34 21.26,18.79 | 3.91,12.89 3.91,13.12 v4.07,13.33 | 19.3,18.29 19.54,18.53 v19.57,18.53 | C11.1 v24.23,23.83 v24.22,23.83
  Top 0.279: IC8.8 3.91,12.89 C21.1
  Top 0.305: 22.55,10.77 22.5,10.82 IC2.2 | 29.14,11.8 IC2.36 | 29.14,11.8 28.53,11.19 23.63,11.19 v23.11,10.67 | v33.73,9.91 L1.1 33.73,9.65 33.68,9.6 | 29.14,11.8 29.14,11.77 v28.55,11.18
  Top 0.406: 27.53,1.83 IC2.18 | IC10.4 20.04,17.55 19.3,18.29 19.05,18.29 R15.1
  Top 0.61: IC10.4 21.26,18.79 21.27,18.82 IC10.3 22.05,21.37 C28.1 | 27.53,1.83 v27.53,1.22 C35.1 | v23.11,10.67 23.11,10.77 22.55,10.77 | 5.35,9.4 C33.1 | 5.35,9.4 v5.32,8.93 | C13.1 26.56,14.62 v25.75,15.43 | R6.1 22.59,26.6 v22.52,26.53
  Bottom 0.254: IC1.71 9.32,27.37 C5.1 8.33,26.78 v8.07,26.53 | IC1.12 24.95,23.87 24.84,23.98 24.84,24.74 24.97,24.87 IC1.10 | R18.1 27.38,1.07 v27.53,1.22 | IC1.42 16.29,14.34 C12.1 15.67,13.9 v15.67,14.13 | IC1.54 8.74,18.87 C14.1 | IC1.96 22.29,32.14 C23.1 21.58,33.12 v21.57,32.88 | IC1.84 16.29,32.04 17.11,32.86 17.16,32.86 C22.1 v17.42,33.23 | IC1.28 23.29,14.56 23.45,14.4 24.72,14.4 v25.75,15.43 | v2.82,10.13 2.8,10.15 | v24.22,23.83 24.37,23.98 | R26.2 R29.2 | R29.2 R30.2 | v25.72,31.98 25.68,33.53 R29.2 | IC12.31 38.4,27.8 38.4,28 | 33.7,31.1 33.32,31.48 IC12.14 33.32,32.98 33,33.3 31.85,33.3 C27.1 31.27,33.88 v31.22,33.88
  Bottom 0.305: v28.55,11.18 28.8,11.43 31.34,11.43 32.87,9.91 v33.73,9.91 | 24.37,23.98 24.84,23.98
  Bottom 0.406: C14.1 9.3,17.74 9.3,16.95 9.67,16.58 v9.67,16.28
  Bottom 0.61: v27.53,1.22 27.47,1.36 | C6.1 22.5,10.65 R4.1 23.03,10.58 v23.11,10.67 | C4.1 9.53,7.57 C3.1 10.54,9.01 9.65,8.13 | 9.65,8.13 9.4,7.87 | 9.65,8.13 9.65,8.38 8.38,9.65 8.38,9.85 8.38,10.21 IC6.4 | 33.7,31.1 37.4,31.1 38.4,30.1 38.4,28
  Bottom 1.016: IC6.2 2.54,10.41 2.8,10.15 3.35,9.6 8.13,9.6 8.38,9.85
  other vias: 11.43,4.49
  pour Inner2: 41.13,16.26 28.45,16.26 28.45,0 2.54,0 arc-90 0,2.54 0,14.46 7.8,14.46 7.8,32.76 0,32.76 0,37.85 arc-90 2.54,40.39 37.59,40.39 arc-90 41.13,37.85
  pour Top: 11.67,5.53 12.48,3.46 10.91,3.46 10.91,5.53
  pour Top: 15.37,6.04 15.37,8.12 17.55,8.12 17.55,6.04
  pour Bottom: 33.7,31.3 37.97,31.3 38.9,30.46 38.9,27.7 35.3,27.7 33.8,29.2
+5V  (via drill 0.5)
  Top 0.406: JST3.2 17.52,36.32 16.9,35.7 v16.5,35.7 | JST2.2 10.3,36.49 v10.3,36.1
  Top 0.61: v23.9,35.7 24.3,35.7 24.77,36.17 JST1.2
  Inner2 0.254: 6.3,29.9 9.7,29.9 11.1,31.3 11.1,33.2 | 10,34.3 11.1,33.2 | 11.1,33.2 9.9,33.2 9.9,33.3
  Inner2 0.406: v16.5,35.7 16.7,35.9 16.4,36.2 | 10.3,36.2 v10.3,36.1 | 9.4,33.3 9.9,33.3 10.6,33.3
  Inner2 0.61: 9.8,34.3 8.4,32.6 4.5,32.6 4,32.3 4,31.31
  Inner2 0.813: 20.1,36.6 20.1,36.7 20.3,36.9 23.2,36.9 v23.9,35.7
  Inner2 1.016: 9.8,34.3 JP1.2 10,34.3 | ENGINE1.2 4,31.31
  Inner2 1.27: 10.04,35.94 9.97,35.94 JP1.2
  Inner2 1.422: 10.04,35.94 10.3,36.2 16.4,36.2 19.7,36.2 20.1,36.6
  Inner2 1.93: 10,34.3 10.04,34.34
  Bottom 0.406: ENGINE1.2 R8.2
  Bottom 1.016: D1.1 1.04,16.49 v1.58,15.79
  pour Inner2: -0.09,31.84 6.97,31.84 7.07,15.19 0,15.19
  pour Inner2: 10.1,34.2 11.1,33.2 11.1,31.3 9.7,29.9 4.2,29.9 4.1,30 4.1,32.4 4.4,32.7 8.1,32.7 9.6,34.2
ACC_INT  (via drill 0.5)
  Top 0.254: IC7.P$4 11.95,2.45 12,2.4 v13.3,2.4
  Bottom 0.254: IC1.56 11.48,19.87 11.7,19.65 11.7,17.15 11.15,16.6 11.15,14.4 14.3,11.25 14.3,10.4 13.9,10 13,10 12.6,9.6 12.6,6.1 13.3,5.4 v13.3,2.4
BAR_INT  (via drill 0.5)
  Top 0.254: IC10.2 23.32,20.43 v23.3,20.45
  Bottom 0.254: v23.3,20.45 23.22,20.37 IC1.57
CONTROLL1_IN  (via drill 0.5)
  Top 0.254: v30.8,38.35 30.7,38.25 | 30.7,38.25 30.65,38.2 | 30.7,38.25 30.7,36.61 JST1.8
  Bottom 0.254: IC1.81 14.79,35.54 16.25,37 29.55,37 v30.8,38.35
CONTROLL2_IN  (via drill 0.5)
  Top 0.254: v30,39.25 29.85,39.1 29.85,36.61 JST1.7
  Bottom 0.254: IC1.80 14.29,35.79 16,37.5 29.2,37.5 29.85,38.15 29.85,39.1 v30,39.25
CONTROLL3_IN  (via drill 0.5)
  Top 0.254: 28.8,38.36 v29,38.55 28.77,38.32 JST1.6
  Bottom 0.254: IC1.79 13.79,36.04 15.75,38 28.45,38 v29,38.55
CONTROLL4_IN  (via drill 0.5)
  Top 0.254: v28.35,39.55 27.77,38.97 JST1.5
  Bottom 0.254: IC1.78 13.29,36.24 15.55,38.5 27.3,38.5 v28.35,39.55
CONTROLL5_IN  (via drill 0.5)
  Top 0.254: v27.15,39.7 26.77,39.32 JST1.4
  Bottom 0.254: IC1.77 12.79,36.44 15.35,39 26.45,39 v27.15,39.7
CONTROLL6_IN  (via drill 0.5)
  Top 0.254: v25.75,39.85 25.77,39.72 JST1.3
  Bottom 0.254: IC1.76 12.29,36.69 15.1,39.5 25.35,39.5 25.85,40 v25.75,39.85
ENGINE1_PWM  (via drill 0.5)
  Top 0.254: v20.37,29.18 v20.38,29.18 R14.1
  Bottom 0.254: IC1.75 20.15,29.37 20.34,29.18 v20.37,29.18
ENGINE2_PWM  (via drill 0.5)
  Top 0.254: R12.1 20.25,27.69 v20.38,27.62
  Bottom 0.254: IC1.74 19.13,28.87 v20.38,27.62
ENGINE3_PWM  (via drill 0.5)
  Top 0.254: R10.1 20.36,26.16 v20.37,26.15
  Bottom 0.254: v20.37,26.15 20.34,26.15 18.13,28.37 IC1.73
ENGINE4_PWM  (via drill 0.5)
  Top 0.254: R9.1 20.05,24.64 v20.37,24.59
  Bottom 0.254: IC1.70 18.07,26.87 20.34,24.59 v20.37,24.59
ENGINE5_PWM  (via drill 0.5)
  Top 0.254: v20.37,23.12 20.4,23.12 R20.1
  Bottom 0.254: IC1.69 17.1,26.37 20.34,23.12 v20.37,23.12
ENGINE6_PWM  (via drill 0.5)
  Top 0.254: v20.37,21.56 20.38,21.56 R21.1
  Bottom 0.254: IC1.68 16.04,25.87 20.34,21.56 v20.37,21.56
GND  (via drill 0.5)
  Top 0.254: IC9.11 16.78,6.12 16.52,6.38 16.02,6.38 15.78,6.14 IC9.9 15.31,5.67 v14.92,5.28 | IC8.1 8.59,13.33 8.38,13.12 6.38,13.12 6.28,13.02 6.28,12.62 | 6.28,12.62 6.28,11.62 | 6.28,11.62 6.28,11.22 7.98,11.22 8.59,10.61 IC8.18 | IC8.9 6.05,12.39 6.28,12.62 | IC8.11 6.05,11.39 6.28,11.62 | IC7.P$3 11.45,1.81 C34.1 | C21.2 1.32,12.16 | C24.1 29.28,17.52 v29.08,17.87 | IC5.2 v16.19,24.35 v16.2,24.34 | v28.28,14.07 C13.2 | C28.2 24.22,21.84 v24.2,22.24 | v32.6,29.74 32.63,29.56 X3.5 | LED2.C LED1.C 20.73,33.83 20.95,34.05 21.16,34.24 v21.1,34.19 | C9.2 13.72,7.3 v13.72,7.28 | X3.M3 33.42,23.02 33.3,22.9 | 39.4,23.34 39.54,23.34 v39.7,23.49 | X3.M1 39.38,32.31 v39.5,32.19 | v19.55,4.1 19.52,4.1 C8.2
  Top 0.305: v18.05,1.4 17.77,1.4 C7.2 | IC2.11 22.8,3.62 v23.11,3.94 | IC8.1 8.59,15.5 v8.45,15.64
  Top 0.406: IC2.15 25.14,1.54 C35.2 | IC11.2 15.25,18.67 14.42,19.5 14.42,21.14 | 14.45,21.21 IC11.4 | 14.42,21.18 14.45,21.21 | 14.42,21.14 14.42,21.18 | 14.44,24.35 IC5.2 | 14.44,24.35 14.42,24.33 14.42,21.18 | 14.42,21.14 14.45,21.21 | 14.44,26.89 IC5.4 | 14.44,26.89 14.42,26.87 14.42,24.37 14.44,24.35 | 14.44,29.43 IC5.6 | 14.44,29.43 14.42,29.41 14.42,26.91 14.44,26.89 | IC5.8 15.24,31.97 14.42,31.15 14.42,29.45 14.44,29.43 | 8.36,7.71 8.06,7.61 C29.2 | v11.65,1.36 C34.1 | C33.2 7.05,8 v7.38,7.67 | 33.68,32.31 34.6,32.64 v34.6,33.99 | 33.3,22.9 39.4,22.9 39.4,23.34 X3.M2 | X3.M3 33.32,23.51 IC12.47 33.82,23.8 35,24.97 v35.1,25.19
  Top 0.61: IC10.1 24.59,21.37 C28.2 24.17,22.03 22.55,23.65 C11.2 C25.1 | 33.68,32.31 X3.M4 | IC5.9 9.88,32.16 v9.8,32.24 | JST2.1 9.26,37.2 v8.8,36.74 | C18.2 13.14,11.15 v13.43,10.87 | 8.06,7.61 7.42,7.61 v7.38,7.67 | JST3.1 16.52,39.92 16.7,40.1 | JST1.1 23.77,38.63 22.3,40.1
  Top 0.813: C21.2 C19.2 1.49,8.27 v1.39,8.17 | 8.3,40.1 8,40.1 | 8.3,40.1 16.7,40.1 22.3,40.1 | v8.5,39.94 8.46,39.94 8.3,40.1
  Inner1 0.813: 36.2,23.9 34.9,25.2 v35.1,25.19
  Bottom 0.254: IC6.1 1.46,8.1 v1.39,8.17 | IC1.72 9.05,27.87 C5.2 8.66,28.48 v8.1,29.04 | 27.29,24.37 IC1.11 | 27.29,24.37 27.63,24.03 27.63,23.6 | IC1.41 16.79,14.38 C12.2 17.74,14.09 v17.55,14.14 | IC1.55 8.77,19.37 8.74,19.52 | 8.74,19.52 C14.2 | IC1.97 22.79,33.21 C23.2 21.93,34.52 v21.1,34.19 | IC1.83 15.79,32.59 C22.2 15.82,33.22 v15.9,33.14 | C6.2 25.74,10.51 v25.94,10.31 | C36.1 28.99,17.95 v29.08,17.87 | 7.8,16.71 7.8,19.05 8.27,19.52 8.74,19.52 | IC1.31 21.79,14.59 21.6,14.4 20.15,14.4 19.8,14.05 19.7,14.05 | v24.2,22.24 24.33,22.37 IC1.15 27.09,22.37 27.63,22.9 27.63,23.6 | 27.29,24.37 27.15,24.38 | IC12.25 39.8,31.07 | IC12.18 35.32,33.38 34.7,34 v34.61,34 v34.6,33.99 | IC12.9 32.15,29.3 v32.6,29.74 | 34.32,24.68 IC12.45 | 34.3,24.8 34.32,24.68 | IC12.47 33.32,24.72 33.4,24.8 34.3,24.8 | 34.32,24.68 34.32,24.72 34.3,24.8 | 34.3,24.8 34.91,24.8 v35.1,25.19 | IC12.34 38.7,26.3 38.6,26.2 | 27.63,23.6 C16.1
  Bottom 0.305: R17.1 26.18,5.23 v26.97,4.44 | v8.45,15.64 8.19,15.56 | C1.2 7.8,16.71
  Bottom 0.406: v27.99,8.71 28.11,8.71 R11.1 | C4.2 7.68,7.37 v7.38,7.67 | C32.2 C20.2 C17.1 v39.7,23.49 39.7,23.9 38.6,25 38.6,26.2 | C30.2 29.4,32.45 v29.4,32.99 29.4,33.35 C27.2
  Bottom 0.61: 6.96,15.56 C1.2 | 6.96,15.56 C2.2 | 8.19,15.56 6.96,15.56 | C3.2 12.48,11.81 v13.43,10.87 | C10.2 C6.2 | IC13.2 31.2,18.4 30.7,17.9 29.76,17.9 v29.08,17.87 | 19.7,14.05 17.76,14.05 v17.55,14.14 | 39.8,31.07 v39.5,32.19 | R31.2 32.59,39.5 v32.7,39.39 | C31.1 38.85,17.85 39.7,18.7 C32.2
  other vias: 13,40.04
  pour Inner1: 41.13,16.26 28.45,16.26 28.45,0 2.54,0 arc-90 0,2.54 0,37.85 arc-90 2.54,40.39 37.59,40.39 arc-90 41.13,37.85
  pour Top: 9.08,13.92 9.08,10.42 5.58,10.42 5.58,13.92
  pour Top: 21.84,12.15 21.84,2.84 28.35,2.84 28.35,3.55 28.4,12.35
GNDRF  (via drill 0.5)
  Top 0.254: J$1.GND@1 38.09,14.22 v39.3,14.22 | v39.24,8.84 39.19,8.89 J$1.GND@2
  Top 0.305: 30.46,11.6 31.66,11.6 IC2.33
  other vias: 36.5,8.84 30.18,14.63 30.13,10.57 30.18,7.42 30.18,4.27 32.31,1.63 33.73,6.71 32,12.8 34.85,14.63 35.05,10.57 36.65,14.22
  pour Top: 39.62,14.89 29.87,14.89 29.87,0 39.62,0
  pour Bottom: 39.62,14.89 29.87,14.89 29.87,0 39.62,0
  pour Inner1: 40.62,14.84 29.86,14.84 29.86,0 40.62,0
  pour Inner2: 40.62,14.84 29.86,14.84 29.86,0 40.62,0
GPSRX  (via drill 0.5)
  Top 0.254: IC2.42 24.34,12.96 23.9,13.4 18.9,13.4 17.9,12.4 v17.95,12.4
  Bottom 0.254: v17.95,12.4 15.5,12.4 14.29,13.61 IC1.46
GPSTX  (via drill 0.5)
  Top 0.254: v17.1,11.55 18.4,11.55 19.37,12.52 IC2.44
  Bottom 0.254: v17.1,11.55 15.55,11.55 13.79,13.31 IC1.47
GYRO_INT  (via drill 0.5)
  Top 0.254: IC8.12 4.24,10.89 v4.15,10.8
  Bottom 0.203: v4.15,10.8 6.1,12.75 6.1,17.3 5.35,18.05 5.35,20 7.35,20 7.8,20.5 7.8,20.75 8.42,21.37 IC1.59
MAG_INT  (via drill 0.5)
  Top 0.254: v12.5,19.55 v12.5,21.2 | IC9.15 v19.19,7.29 v19.2,7.3
  Bottom 0.254: v12.5,19.55 12.2,19.25 12.2,16.95 11.7,16.45 11.7,14.6 16.15,10.15 16.15,9.45 18.3,7.3 v19.2,7.3 | v12.5,21.2 12.17,20.87 IC1.58
N$1
  Top 0.254: IC9.10 16.28,5.12 16.32,5.08 16.32,4.88
  Top 0.61: 16.32,4.88 16.32,2.28 15.46,1.42 14.94,1.42 C7.1
N$2
  Top 0.406: X3.2 33.14,27.06 31.5,27.05 27.15,27.05 26.95,27.25 26.95,29.75 27.5,30.3 R25.2
N$3
  Top 0.406: ENGINE4.1 2.79,24.89 7.11,24.89 7.65,24.35 IC5.15
N$4  (via drill 0.5)
  Top 0.254: R25.1 29.25,30.05 v29.9,29.4
  Bottom 0.254: IC12.8 30.5,28.8 v29.9,29.4
N$5
  Top 0.406: ENGINE6.3 7.15,18.54 8.29,17.4 IC11.8
  Bottom 0.406: R13.1 ENGINE6.3
N$6
  Top 0.406: ENGINE6.1 2.79,19.81 7.11,19.81 8.26,18.67 IC11.7
N$7  (via drill 0.5)
  Top 0.254: R24.1 27.95,28.55 v28.4,29
  Bottom 0.254: IC12.7 28.85,28.3 R22.2 28.4,28.75 v28.4,29
N$8
  Top 0.254: IC9.8 14.63,6.29 14.31,6.23
  Top 0.61: 14.31,6.23 13.87,5.78 13.87,4.61 C15.1
N$9  (via drill 0.5)
  Top 0.254: R2.1 23.45,31.6 23.4,31.25 v23.4,28.5
  Bottom 0.254: IC1.95 21.79,30.11 v23.4,28.5
N$10
  Top 0.254: 17.43,5.67 IC9.12
  Top 0.305: 17.52,5.58 17.43,5.67
  Top 0.61: C15.2 17.73,5.37 17.52,5.58
N$11
  Bottom 0.406: R13.2 ENGINE6.2
N$12
  Top 0.406: ENGINE5.3 7.18,21.08 8.32,19.94 IC11.6
  Bottom 0.406: R19.2 ENGINE5.3
N$13
  Top 0.305: IC8.20 11.25,11.39 C18.1
N$14
  Top 0.279: IC8.10 3.38,11.89 3.17,11.68 3.67,11.9 C19.1
N$15
  Top 0.254: R2.2 22.15,31.45 22.05,31.4 20.85,31.4 LED1.A
N$16  (via drill 0.5)
  Top 0.254: X3.1 33.44,26.26 v33.9,25.8
  Inner2 0.254: v33.9,25.8 33.9,25.7
  Inner2 1.016: v29.7,23.6 31.8,25.7 33.9,25.7 33.9,24.7 36.55,22.05 37.45,22.05 v37.65,21.85 38.3,21.2 38.3,17.5 37.3,16.5 v36.8,16.5 36.6,16.3 v29.1,16.3 | 7.3,35.1 7.3,37.3 8.1,38.1 25.5,38.1 27.7,35.9 34.5,35.9 35.3,35.1 35.3,31.7 34.8,31.2 34.8,28.1 34,27.3 34,25.9 v33.9,25.8
  Inner2 1.93: 7.3,34.4 7.3,35.1
  Bottom 0.254: IC12.3 IC12.4 | 36.85,21.95 35.82,22.98 IC12.42 35.82,22.88 36.7,22 37.5,22 37.55,21.95 | 37.55,21.95 C17.2 | v37.65,21.85 37.55,21.95 | R23.2 36.75,16.45 v36.8,16.5 | IC13.6 29.55,16.75 v29.1,16.3 | IC12.3 31.32,26.42 31.4,26.5 | 31,26.5 31.42,26.5 IC12.3
  Bottom 0.406: 37.55,21.95 36.85,21.95
  Bottom 0.61: IC13.6 29.45,16.75 C36.2 | v29.7,23.6 R28.1 29.6,23.5 | 31.4,26.5 31.42,26.5 33.2,26.5 v33.9,25.8 | C16.2 28.8,25.3 30,26.5 31,26.5
  pour Inner2: 7.5,34.5 0,34.5 0,39 2,41 39,41 41,39 41,16.5 37.5,16.5 38.5,17.5 38.5,21 37.5,22 37,22 34,25 34,27.5 35,28.5 35,34.5 35.5,35 34.5,36 27.5,36 25.5,38 8.5,38 7.5,37
  pour Bottom: 35.7,23.4 35.7,21.8 35.9,21.6 37.3,21.6 37.3,23.4
N$17
  Top 0.406: IC5.16 7.14,23.08 ENGINE4.3
  Bottom 0.406: R1.1 ENGINE4.3
N$18  (via drill 0.5)
  Top 0.254: R3.1 21.7,28.85
  Bottom 0.254: IC1.94 21.29,29.26 R3.1
  other vias: 22.05,28.5
N$19
  Top 0.305: IC2.32 32.36,10.82 33.33,11.79 33.33,11.93 L1.2 34.62,11.43 J$1.SIG
N$20
  Top 0.254: R3.2 20.4,30.2 19.25,31.35 LED2.A
N$21  (via drill 0.5)
  Top 0.254: IC2.1 20.58,11.62 v20.45,11.45
  Bottom 0.254: v20.45,11.45 21.67,11.45 R4.2
  Bottom 0.61: R4.2 24.04,12.28 C10.1
N$22
  Bottom 0.406: ENGINE4.2 R1.2
N$23
  Bottom 0.61: 1.99,14.38 1.99,13.78 IC6.3 | 1.99,14.38 D1.3 | C2.1 4.85,15.76 C1.1 5.2,14.86 4.83,14.38 1.99,14.38
N$24
  Top 0.406: ENGINE3.1 2.79,27.43 8.56,27.43 9.1,26.89 IC5.13
N$25
  Top 0.406: IC5.14 7.14,25.62 ENGINE3.3
  Bottom 0.406: R5.1 ENGINE3.3
N$26
  Bottom 0.406: ENGINE3.2 R5.2
N$27
  Top 0.406: IC5.12 7.14,28.16 ENGINE2.3
  Bottom 0.406: R7.1 ENGINE2.3
N$28
  Top 0.406: ENGINE2.1 2.79,29.97 8.51,29.97 9.05,29.43 IC5.11
N$29
  Bottom 0.406: R7.2 ENGINE2.2
N$30
  Top 0.406: IC5.10 7.14,30.7 ENGINE1.3
  Bottom 0.406: R8.1 ENGINE1.3
N$31
  Top 0.305: IC5.1 16.78,23.08 18.09,24.38 18.45,24.38 R9.2
N$32
  Top 0.305: IC5.3 17.89,25.62 18.33,26.06 R10.2
N$33
  Top 0.305: IC5.5 17.96,28.16 18.43,27.69 R12.2
N$34
  Top 0.305: IC5.7 17.22,30.7 R14.2
N$35  (via drill 0.5)
  Top 0.305: IC2.9 23.63,5.22 v23.88,5.18
  Bottom 0.305: v23.88,5.18 23.94,5.18 R17.2
N$36
  Bottom 0.406: R19.1 ENGINE5.2
N$37
  Top 0.406: ENGINE5.1 2.79,22.35 7.11,22.35 8.26,21.21 IC11.5
N$38
  Top 0.305: IC11.1 16.89,17.4 17.72,18.23 17.72,19.75 18.43,20.47 18.43,21.32 R21.2
N$39  (via drill 0.5)
  Top 0.254: v24.03,1.07 LED3.A
  Bottom 0.254: R18.2 v24.03,1.07
N$40
  Top 0.305: IC2.7 21.15,6.82 20.78,6.45 20.78,2.64 21.84,1.57 21.84,1.59 LED3.C
N$41
  Top 0.305: IC11.3 16.89,19.94 17.62,20.67 17.62,22.35 18.29,23.01 R20.2
N$42  (via drill 0.5)
  Top 0.254: v27.59,20.22 v27.58,20.22 27.58,24.28 Q2.3
  Top 0.279: Q2.3 24.6,25.48 C25.2
  Bottom 0.254: IC1.22 27.2,18.87 27.59,19.25 v27.59,20.22
N$43  (via drill 0.5)
  Top 0.254: Q2.1 29.13,21.48 29.13,19.62 | 29.13,19.62 C24.2 | v28.65,19.56 28.98,19.47 29.13,19.62
  Bottom 0.254: IC1.23 27.46,18.37 v28.65,19.56
N$45
  Top 0.406: X3.3 29.74,27.86 R24.2
N$46
  Bottom 0.254: IC13.4 32.15,17.65 32.85,18.35 32.85,20.84 31.59,22.1 31.5,22.2 31.32,22.38 IC12.1
N$47
  Bottom 0.254: 33.9,21.45 33.82,21.63 IC12.46
  Bottom 0.406: R23.1 C31.2 | 33.9,21.45 34.75,20.6 34.75,20.35
  Bottom 0.813: C31.2 34.75,20.35
  pour Bottom: 32.8,23.9 34.6,23.9 34.6,21.7 36,20.3 36,19.2 35.4,18.9 33.9,18.9 33.5,19 33.5,20.9 32.8,21.6
N$48
  Bottom 0.254: IC12.6 32.5,27.8 32.6,27.9 | 31.3,31.9 31.3,31.4 | 31.3,31.9 31.3,32 | 31.6,31.6 31.3,31.9
  Bottom 0.406: C30.1 31.25,32.35 32.5,31.1 32.6,31.1 33.7,30 33.7,29.1 32.6,27.9
  pour Bottom: 31.3,32.3 32.3,32.3 32.9,31.7 32.9,30.9 33.8,30 33.8,28.5 33.1,27.8 31.3,27.8 31.3,31.9 31.4,32
N$49
  Bottom 0.254: IC13.5 31.2,16.3 31.65,15.85 32.65,15.85 32.95,16.15 32.95,17.6 33.4,18.05 33.4,21.15 32.82,21.73 IC12.48
N$51
  Bottom 0.254: IC12.5 28.85,27.3 R22.1
N$52  (via drill 0.5)
  Top 0.254: Q1.3 38.25,17.85 37,19.1 v37,20.6
  Bottom 0.254: v37,20.6 38.1,20.6 37.75,20.65 36.45,20.65 35.32,21.78 IC12.43
  Bottom 0.406: C20.1 37.95,20.65 37.75,20.65
N$53  (via drill 0.5)
  Top 0.254: Q1.1 33.55,19.25 v35.9,19.25
  Bottom 0.254: IC12.44 34.82,21.53 36,20.35 36,19.35 36.05,19.3 36.45,19.25 | v35.9,19.25 36.45,19.25 | 36.45,19.25 C32.1
N$54
  Bottom 0.254: IC13.3 32.15,19.9 R27.2 31.5,20.9 30.75,21.65 30.75,24.5 30.3,24.95 30.3,25.55 30.55,25.8 IC12.2
N$55
  Bottom 0.254: IC13.1 30.25,20.1 R27.1
  Bottom 0.61: R27.1 29.65,20.95 R28.2
PPS  (via drill 0.5)
  Top 0.254: IC2.40 25.94,13.01 25.05,13.9 20.05,13.9 18.95,15 9.8,15 9.75,14.95 v9.7,14.95
  Bottom 0.254: v9.7,14.95 10.54,15.79 IC1.51
RESET  (via drill 0.5)
  Top 0.254: R6.2 24.55,26.5 25.6,27.55 25.6,30.6 29.8,34.8 32.3,34.8 v32.95,34.15
  Bottom 0.254: IC1.17 23.83,21.37 23.3,21.9 23.3,25.55 R6.2 | v32.95,34.15 33.65,33.45 33.95,33.45 34.32,33.08 IC12.16
  other vias: 24.25,26.5
RX/SCL_2  (via drill 0.5)
  Top 0.254: v13.15,17.85 13.85,18.55 13.85,32.35 15.7,34.2 17.3,34.2 19.55,36.45 19.55,37.16 JST3.4
  Bottom 0.254: IC1.49 12.79,17.49 v13.15,17.85
RXD0  (via drill 0.5)
  Top 0.254: v23.95,34 24.3,34.35 25.95,34.35 27,35.4 34.6,35.4 35.45,34.55 35.45,27.2 v35.8,26.85
  Bottom 0.254: IC1.99 23.79,33.84 v23.95,34 | IC12.40 36.82,24.72 37.4,25.3 37.4,26.2 37,26.6 36.05,26.6 v35.8,26.85
RXD1  (via drill 0.5)
  Top 0.254: v12.5,24.35 12.21,24.64 JST2.4
  Bottom 0.254: IC1.63 11.52,23.37 v12.5,24.35
SCL  (via drill 0.5)
  Top 0.254: IC10.6 23.27,15.54 23.27,16.26 22.82,16.7 | 22.82,16.7 R15.2 | 22.82,16.7 22.87,16.7 v22.87,17.28 | IC8.23 9.81,12.89 10.25,12.45 14.21,12.45 16.1,10.56 16.1,10 | 17.28,8.47 17.28,9.67 v17.15,9.8 16.95,10 16.1,10 | IC7.P$7 12.45,9.75 12.7,10 16.1,10
  Top 0.279: 17.28,8.47 IC9.1
  Bottom 0.254: 24.25,17.87 23.46,17.87 v22.87,17.28 | 24.25,17.87 IC1.24 | v17.15,9.8 17.15,10.35 20.6,13.8 25.55,13.8 26.7,14.95 26.7,16.3 26.2,16.8 24.75,16.8 24.25,17.3 24.25,17.87
SDA  (via drill 0.5)
  Top 0.254: IC10.7 25.39,16.29 27.64,16.28 R16.2 | R16.2 27.69,16.65 R16.2 | IC8.24 10.06,13.39 10.5,12.95 14.41,12.95 16.66,10.7 v18.75,10.7 18.5,10.45 18.5,8.2 18.09,7.79 IC9.16 | IC7.P$9 11.45,7.25 v11.5,7.3
  Bottom 0.254: IC1.25 26.97,17.37 R16.2 27.6,16.67 27.6,15.1 25.8,13.3 20.85,13.3 18.95,11.4 18.95,11 18.75,10.8 v18.75,10.7 20.1,9.35 20.1,6.8 14.8,1.5 12.8,1.5 12.4,1.9 12.4,5.2 11.5,6.1 v11.5,7.3
  other vias: 27.64,16.7
TCK  (via drill 0.5)
  Top 0.254: v24.5,28 24.7,28.2 24.7,32.4 24.5,32.6 24,32.6 21.6,35 v21.6,35.8 21.6,35.55
  Bottom 0.254: IC12.24 38.32,33.83 35.4,36.75 32.35,36.75 | 32.35,36.75 R31.1 | IC1.5 25.13,27.37 v24.5,28 | v21.6,35.8 21.7,35.85 22.35,36.5 30.05,36.5 30.3,36.75 32.35,36.75
TDI
  Bottom 0.254: IC12.23 37.82,33.58 35.2,36.2 30.6,36.2 30.2,35.8 28.15,35.8 R30.1 26.5,35.95 24.95,35.95 24.8,35.8 24.8,29.1 25.03,28.87 IC1.2
TDO
  Bottom 0.254: IC12.22 37.32,33.33 35.05,35.6 30.8,35.6 30.4,35.2 28.6,35.2 28.3,34.9 28.3,34.3 27.9,33.9 27.75,33.9 R29.1 | R29.1 27.1,33.35 26.55,32.8 26.55,29.88 IC1.1 | R29.1 27.6,33.55
TMS
  Bottom 0.254: IC12.21 36.82,33.08 34.9,35 31,35 30.6,34.6 28.9,34.6 28.8,34.5 28.8,34 28.3,33.5 28.3,32.45 28,32.15 R26.1 27.4,28.85 26.92,28.37 IC1.3
TX/SDA_2  (via drill 0.5)
  Top 0.254: v14.1,17.1 13.95,16.95 12.8,16.95 12.25,17.5 12.25,18.3 12.65,18.7 12.9,18.7 13.35,19.15 13.35,32.6 15.5,34.75 16.85,34.75 18.55,36.45 18.55,37.26 JST3.3
  Bottom 0.254: IC1.48 13.29,16.59 13.8,17.1 v14.1,17.1
TXD0  (via drill 0.5)
  Top 0.254: v37.15,27.45 37.25,27.55 37.25,33.55 34.8,36 26.6,36 25.5,34.9 23.4,34.9 22.95,35.35 v22.75,35.35
  Bottom 0.254: IC1.98 23.29,33.41 22.75,33.95 v22.75,35.35 | 37.32,27.28 v37.15,27.45 37.9,26.7 37.9,25.1 37.32,24.52 IC12.39
TXD1  (via drill 0.5)
  Top 0.254: v12.35,22.85 11.55,23.65 11.55,36.5 11.2,36.85 11.2,37 11.1,37.1 11.1,37.08 JST2.3
  Bottom 0.254: IC1.62 12.33,22.87 v12.35,22.85

### Text on the board
_tsilk: INPUT | USB | 1 | PWR | R2 | R25 | R3 | R24 | R6 | C25 | C11 | Q2 | C28 | C24 | R15 | Q1 | 6 | OUTPUT | R16 | C21 | KFly | C13 | L1 | C19 | C18 | v1.0 | MAG | GYR | C9 | GPS | C26 | ANT | C33 | C29 | C8 | ACC | C15 | C34 | C35 | C7
_bsilk: R31 | R30 | C22 | C27 | C23 | R29 | C30 | R26 | R22 | FT2232D | C16 | C5 | C14 | R28 | C17 | LPC176x | R27 | C20 | C1 | C31 | C32 | C2 | R23 | D1 | C12 | R4 | C10 | C36 | C3 | C9 | R11 | R17 | C4 | R18